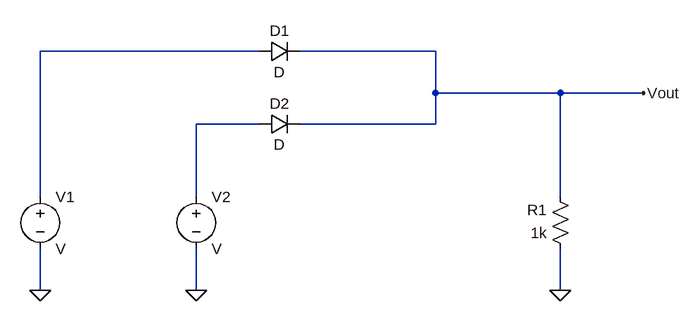
[diagram p0: schematic OR_Gate_Positive.asc]
OR_Gate_Positive.asc, the LTspice schematic file:
Version 4
SHEET 1 880 680
WIRE -64 -176 -400 -176
WIRE 208 -176 0 -176
WIRE 208 -112 208 -176
WIRE 400 -112 208 -112
WIRE 528 -112 400 -112
WIRE -64 -64 -160 -64
WIRE 208 -64 208 -112
WIRE 208 -64 0 -64
WIRE -400 48 -400 -176
WIRE -160 48 -160 -64
WIRE 400 48 400 -112
WIRE -400 192 -400 128
WIRE -160 192 -160 128
WIRE 400 192 400 128
FLAG -400 192 0
FLAG -160 192 0
FLAG 400 192 0
FLAG 528 -112 Vout
SYMBOL voltage -400 32 R0
SYMATTR InstName V1
SYMBOL voltage -160 32 R0
SYMATTR InstName V2
SYMBOL res 416 144 R180
WINDOW 0 36 76 Left 2
WINDOW 3 36 40 Left 2
SYMATTR InstName R1
SYMATTR Value 1k
SYMBOL diode -64 -160 R270
WINDOW 0 32 32 VTop 2
WINDOW 3 0 32 VBottom 2
SYMATTR InstName D1
SYMBOL diode -64 -48 R270
WINDOW 0 32 32 VTop 2
WINDOW 3 0 32 VBottom 2
SYMATTR InstName D2

The netlist it stands for:
* OR_Gate_Positive.asc
V1 N001 0 V
V2 N002 0 V
R1 0 Vout 1k
D1 N001 Vout D
D2 N002 Vout D
.model D D
.lib standard.dio
.backanno
.end